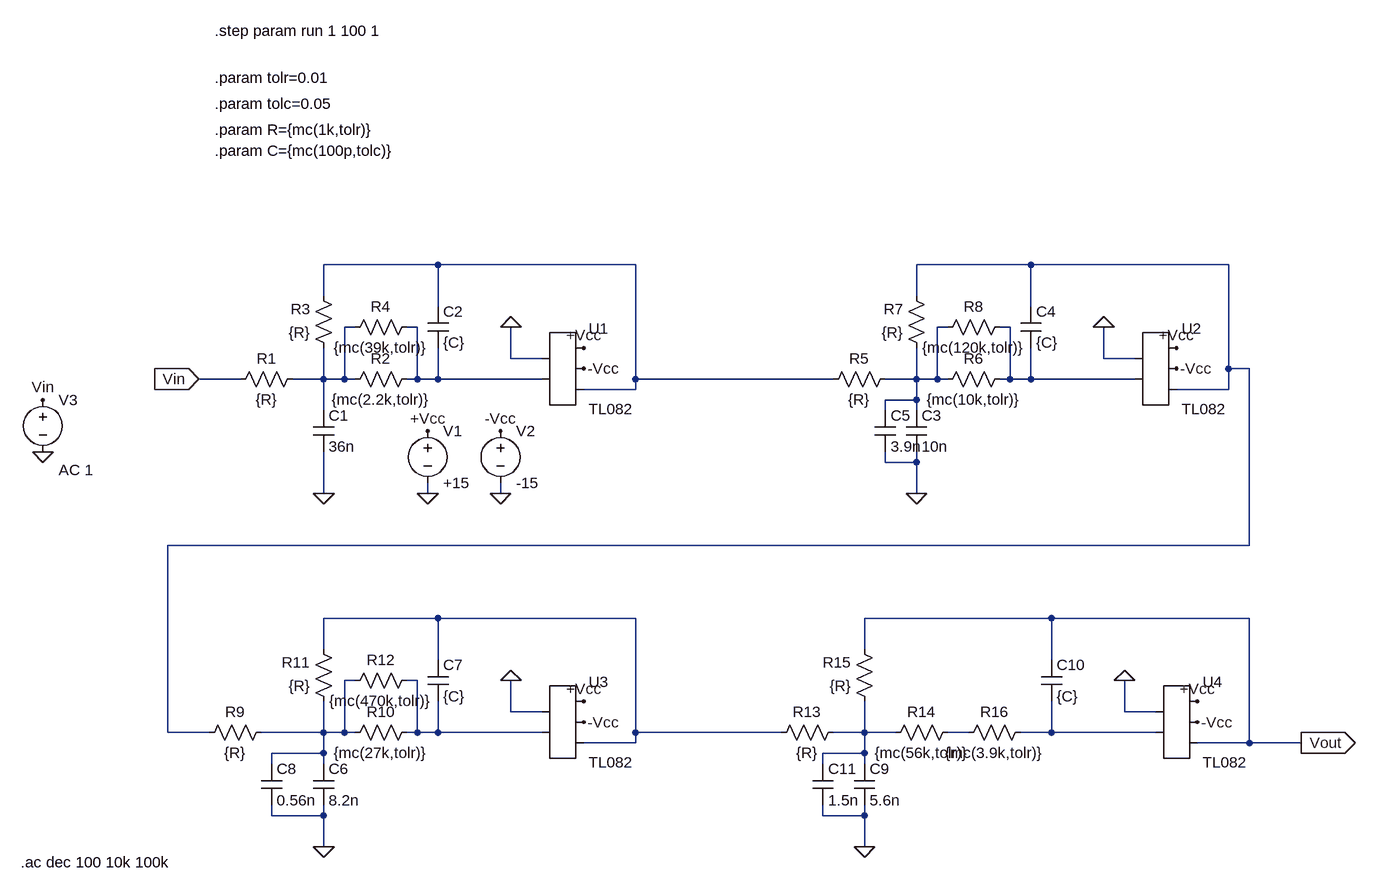
[diagram p0: schematic Filter.asc]
Filter.asc, the LTspice schematic file:
Version 4
SHEET 1 2392 1076
WIRE -176 96 -352 96
WIRE 128 96 -176 96
WIRE 736 96 560 96
WIRE 1040 96 736 96
WIRE -352 144 -352 96
WIRE 560 144 560 96
WIRE -176 160 -176 96
WIRE 736 160 736 96
WIRE -304 192 -320 192
WIRE -208 192 -224 192
WIRE 608 192 592 192
WIRE 704 192 688 192
WIRE -64 240 -64 192
WIRE -16 240 -64 240
WIRE 848 240 848 192
WIRE 896 240 848 240
WIRE 1040 256 1040 96
WIRE 1072 256 1040 256
WIRE -480 272 -544 272
WIRE -352 272 -352 224
WIRE -352 272 -400 272
WIRE -320 272 -320 192
WIRE -320 272 -352 272
WIRE -304 272 -320 272
WIRE -208 272 -208 192
WIRE -208 272 -224 272
WIRE -176 272 -176 224
WIRE -176 272 -208 272
WIRE -16 272 -176 272
WIRE 128 272 128 96
WIRE 432 272 128 272
WIRE 560 272 560 224
WIRE 560 272 512 272
WIRE 592 272 592 192
WIRE 592 272 560 272
WIRE 608 272 592 272
WIRE 704 272 704 192
WIRE 704 272 688 272
WIRE 736 272 736 224
WIRE 736 272 704 272
WIRE 896 272 736 272
WIRE 128 288 128 272
WIRE 128 288 48 288
WIRE 1040 288 1040 256
WIRE 1040 288 960 288
WIRE 560 304 560 272
WIRE 560 304 512 304
WIRE -352 320 -352 272
WIRE 512 320 512 304
WIRE 560 320 560 304
WIRE 512 400 512 384
WIRE 560 400 560 384
WIRE 560 400 512 400
WIRE -352 448 -352 384
WIRE -192 448 -192 432
WIRE -80 448 -80 432
WIRE 560 448 560 400
WIRE 1072 528 1072 256
WIRE 1072 528 -592 528
WIRE -176 640 -352 640
WIRE 128 640 -176 640
WIRE 768 640 480 640
WIRE 1072 640 768 640
WIRE -352 688 -352 640
WIRE 480 688 480 640
WIRE -176 704 -176 640
WIRE 768 704 768 640
WIRE -304 736 -320 736
WIRE -208 736 -224 736
WIRE -64 784 -64 736
WIRE -16 784 -64 784
WIRE 880 784 880 736
WIRE 928 784 880 784
WIRE -592 816 -592 528
WIRE -528 816 -592 816
WIRE -352 816 -352 768
WIRE -352 816 -448 816
WIRE -320 816 -320 736
WIRE -320 816 -352 816
WIRE -304 816 -320 816
WIRE -208 816 -208 736
WIRE -208 816 -224 816
WIRE -176 816 -176 768
WIRE -176 816 -208 816
WIRE -16 816 -176 816
WIRE 128 816 128 640
WIRE 352 816 128 816
WIRE 480 816 480 768
WIRE 480 816 432 816
WIRE 528 816 480 816
WIRE 640 816 608 816
WIRE 768 816 768 768
WIRE 768 816 720 816
WIRE 928 816 768 816
WIRE 128 832 128 816
WIRE 128 832 48 832
WIRE 1072 832 1072 640
WIRE 1072 832 992 832
WIRE 1152 832 1072 832
WIRE -352 848 -352 816
WIRE -352 848 -432 848
WIRE 480 848 480 816
WIRE 480 848 416 848
WIRE -432 864 -432 848
WIRE -352 864 -352 848
WIRE 416 864 416 848
WIRE 480 864 480 848
WIRE -432 944 -432 928
WIRE -352 944 -352 928
WIRE -352 944 -432 944
WIRE 416 944 416 928
WIRE 480 944 480 928
WIRE 480 944 416 944
WIRE -352 992 -352 944
WIRE 480 992 480 944
FLAG -192 448 0
FLAG -80 448 0
FLAG -64 192 0
FLAG -352 448 0
FLAG -544 272 Vin
IOPIN -544 272 In
FLAG 48 224 +Vcc
FLAG -192 352 +Vcc
FLAG 48 256 -Vcc
FLAG -80 352 -Vcc
FLAG 848 192 0
FLAG 560 448 0
FLAG 960 224 +Vcc
FLAG 960 256 -Vcc
FLAG -64 736 0
FLAG -352 992 0
FLAG 48 768 +Vcc
FLAG 48 800 -Vcc
FLAG 880 736 0
FLAG 480 992 0
FLAG 1152 832 Vout
IOPIN 1152 832 Out
FLAG 992 768 +Vcc
FLAG 992 800 -Vcc
FLAG -784 384 0
FLAG -784 304 Vin
SYMBOL AutoGenerated\\TL082 16 256 R0
SYMATTR InstName U1
SYMBOL voltage -192 336 R0
WINDOW 123 0 0 Left 0
WINDOW 39 0 0 Left 0
SYMATTR InstName V1
SYMATTR Value +15
SYMBOL voltage -80 336 R0
WINDOW 123 0 0 Left 0
WINDOW 39 0 0 Left 0
SYMATTR InstName V2
SYMATTR Value -15
SYMBOL res -384 256 R90
WINDOW 0 0 56 VBottom 2
WINDOW 3 32 56 VTop 2
SYMATTR InstName R1
SYMATTR Value {R}
SYMBOL res -208 256 R90
WINDOW 0 0 56 VBottom 2
WINDOW 3 32 56 VTop 2
SYMATTR InstName R2
SYMATTR Value {mc(2.2k,tolr)}
SYMBOL res -336 240 R180
WINDOW 0 36 76 Left 2
WINDOW 3 36 40 Left 2
SYMATTR InstName R3
SYMATTR Value {R}
SYMBOL cap -368 320 R0
SYMATTR InstName C1
SYMATTR Value 36n
SYMBOL cap -192 160 R0
SYMATTR InstName C2
SYMATTR Value {C}
SYMBOL res -208 176 R90
WINDOW 0 0 56 VBottom 2
WINDOW 3 32 56 VTop 2
SYMATTR InstName R4
SYMATTR Value {mc(39k,tolr)}
SYMBOL AutoGenerated\\TL082 928 256 R0
SYMATTR InstName U2
SYMBOL res 528 256 R90
WINDOW 0 0 56 VBottom 2
WINDOW 3 32 56 VTop 2
SYMATTR InstName R5
SYMATTR Value {R}
SYMBOL res 704 256 R90
WINDOW 0 0 56 VBottom 2
WINDOW 3 32 56 VTop 2
SYMATTR InstName R6
SYMATTR Value {mc(10k,tolr)}
SYMBOL res 576 240 R180
WINDOW 0 36 76 Left 2
WINDOW 3 36 40 Left 2
SYMATTR InstName R7
SYMATTR Value {R}
SYMBOL cap 544 320 R0
SYMATTR InstName C3
SYMATTR Value 10n
SYMBOL cap 720 160 R0
SYMATTR InstName C4
SYMATTR Value {C}
SYMBOL cap 496 320 R0
SYMATTR InstName C5
SYMATTR Value 3.9n
SYMBOL res 704 176 R90
WINDOW 0 0 56 VBottom 2
WINDOW 3 32 56 VTop 2
SYMATTR InstName R8
SYMATTR Value {mc(120k,tolr)}
SYMBOL AutoGenerated\\TL082 16 800 R0
SYMATTR InstName U3
SYMBOL res -432 800 R90
WINDOW 0 0 56 VBottom 2
WINDOW 3 32 56 VTop 2
SYMATTR InstName R9
SYMATTR Value {R}
SYMBOL res -208 800 R90
WINDOW 0 0 56 VBottom 2
WINDOW 3 32 56 VTop 2
SYMATTR InstName R10
SYMATTR Value {mc(27k,tolr)}
SYMBOL res -336 784 R180
WINDOW 0 36 76 Left 2
WINDOW 3 36 40 Left 2
SYMATTR InstName R11
SYMATTR Value {R}
SYMBOL cap -368 864 R0
SYMATTR InstName C6
SYMATTR Value 8.2n
SYMBOL cap -192 704 R0
SYMATTR InstName C7
SYMATTR Value {C}
SYMBOL cap -448 864 R0
SYMATTR InstName C8
SYMATTR Value 0.56n
SYMBOL res -208 720 R90
WINDOW 0 0 56 VBottom 2
WINDOW 3 32 56 VTop 2
SYMATTR InstName R12
SYMATTR Value {mc(470k,tolr)}
SYMBOL AutoGenerated\\TL082 960 800 R0
SYMATTR InstName U4
SYMBOL res 448 800 R90
WINDOW 0 0 56 VBottom 2
WINDOW 3 32 56 VTop 2
SYMATTR InstName R13
SYMATTR Value {R}
SYMBOL res 624 800 R90
WINDOW 0 0 56 VBottom 2
WINDOW 3 32 56 VTop 2
SYMATTR InstName R14
SYMATTR Value {mc(56k,tolr)}
SYMBOL res 496 784 R180
WINDOW 0 36 76 Left 2
WINDOW 3 36 40 Left 2
SYMATTR InstName R15
SYMATTR Value {R}
SYMBOL cap 464 864 R0
SYMATTR InstName C9
SYMATTR Value 5.6n
SYMBOL cap 752 704 R0
SYMATTR InstName C10
SYMATTR Value {C}
SYMBOL cap 400 864 R0
SYMATTR InstName C11
SYMATTR Value 1.5n
SYMBOL res 736 800 R90
WINDOW 0 0 56 VBottom 2
WINDOW 3 32 56 VTop 2
SYMATTR InstName R16
SYMATTR Value {mc(3.9k,tolr)}
SYMBOL voltage -784 288 R0
WINDOW 123 24 124 Left 2
WINDOW 39 0 0 Left 0
SYMATTR InstName V3
SYMATTR Value ""
SYMATTR Value2 AC 1
TEXT -520 -192 Left 2 !.param tolr=0.01
TEXT -520 -152 Left 2 !.param tolc=0.05
TEXT -520 -264 Left 2 !.step param run 1 100 1
TEXT -818 1016 Left 2 !.ac dec 100 10k 100k
TEXT -520 -112 Left 2 !.param R={mc(1k,tolr)}
TEXT -520 -80 Left 2 !.param C={mc(100p,tolc)}

The netlist it stands for:
* Filter.asc
* U1: TL082 (symbol AutoGenerated\TL082 not available, pins judged from their places): pin1=0 pin2=N004 pin3=+Vcc pin4=-Vcc pin5=N001
V1 +Vcc 0 +15
V2 -Vcc 0 -15
R1 N003 Vin {R}
R2 N004 N003 {mc(2.2k,tolr)}
R3 N003 N001 {R}
C1 N003 0 36n
C2 N001 N004 {C}
R4 N004 N003 {mc(39k,tolr)}
* U2: TL082 (symbol AutoGenerated\TL082 not available, pins judged from their places): pin1=0 pin2=N006 pin3=+Vcc pin4=-Vcc pin5=N002
R5 N005 N001 {R}
R6 N006 N005 {mc(10k,tolr)}
R7 N005 N002 {R}
C3 N005 0 10n
C4 N002 N006 {C}
C5 N005 0 3.9n
R8 N006 N005 {mc(120k,tolr)}
* U3: TL082 (symbol AutoGenerated\TL082 not available, pins judged from their places): pin1=0 pin2=N009 pin3=+Vcc pin4=-Vcc pin5=N007
R9 N008 N002 {R}
R10 N009 N008 {mc(27k,tolr)}
R11 N008 N007 {R}
C6 N008 0 8.2n
C7 N007 N009 {C}
C8 N008 0 0.56n
R12 N009 N008 {mc(470k,tolr)}
* U4: TL082 (symbol AutoGenerated\TL082 not available, pins judged from their places): pin1=0 pin2=N012 pin3=+Vcc pin4=-Vcc pin5=Vout
R13 N010 N007 {R}
R14 N011 N010 {mc(56k,tolr)}
R15 N010 Vout {R}
C9 N010 0 5.6n
C10 Vout N012 {C}
C11 N010 0 1.5n
R16 N012 N011 {mc(3.9k,tolr)}
V3 Vin 0 AC 1
.param tolr=0.01
.param tolc=0.05
.step param run 1 100 1
.ac dec 100 10k 100k
.param R={mc(1k,tolr)}
.param C={mc(100p,tolc)}
.backanno
.end